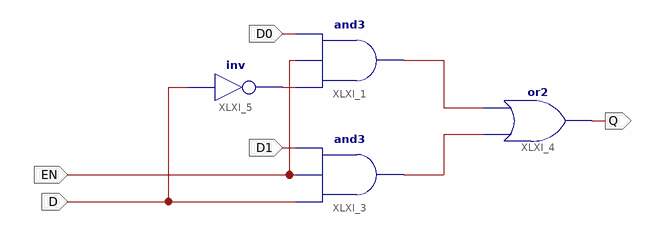
[diagram p0: schematic sheet 1]
// Xilinx ISE schematic MUX_2_TO_1.sch (spartan3e) as structural Verilog: 4 symbols, 5 ports
module MUX_2_TO_1 (
  input  D,
  input  EN,
  input  D0,
  input  D1,
  output Q
);

  wire XLXN_1, XLXN_2, XLXN_3;

  and XLXI_1 (XLXN_1, XLXN_3, EN, D0);
  and XLXI_3 (XLXN_2, D, EN, D1);
  or XLXI_4 (Q, XLXN_2, XLXN_1);
  not XLXI_5 (XLXN_3, D);
endmodule
